# EAGLE design lvds-omnetics_BOB (EAGLE 6.4)
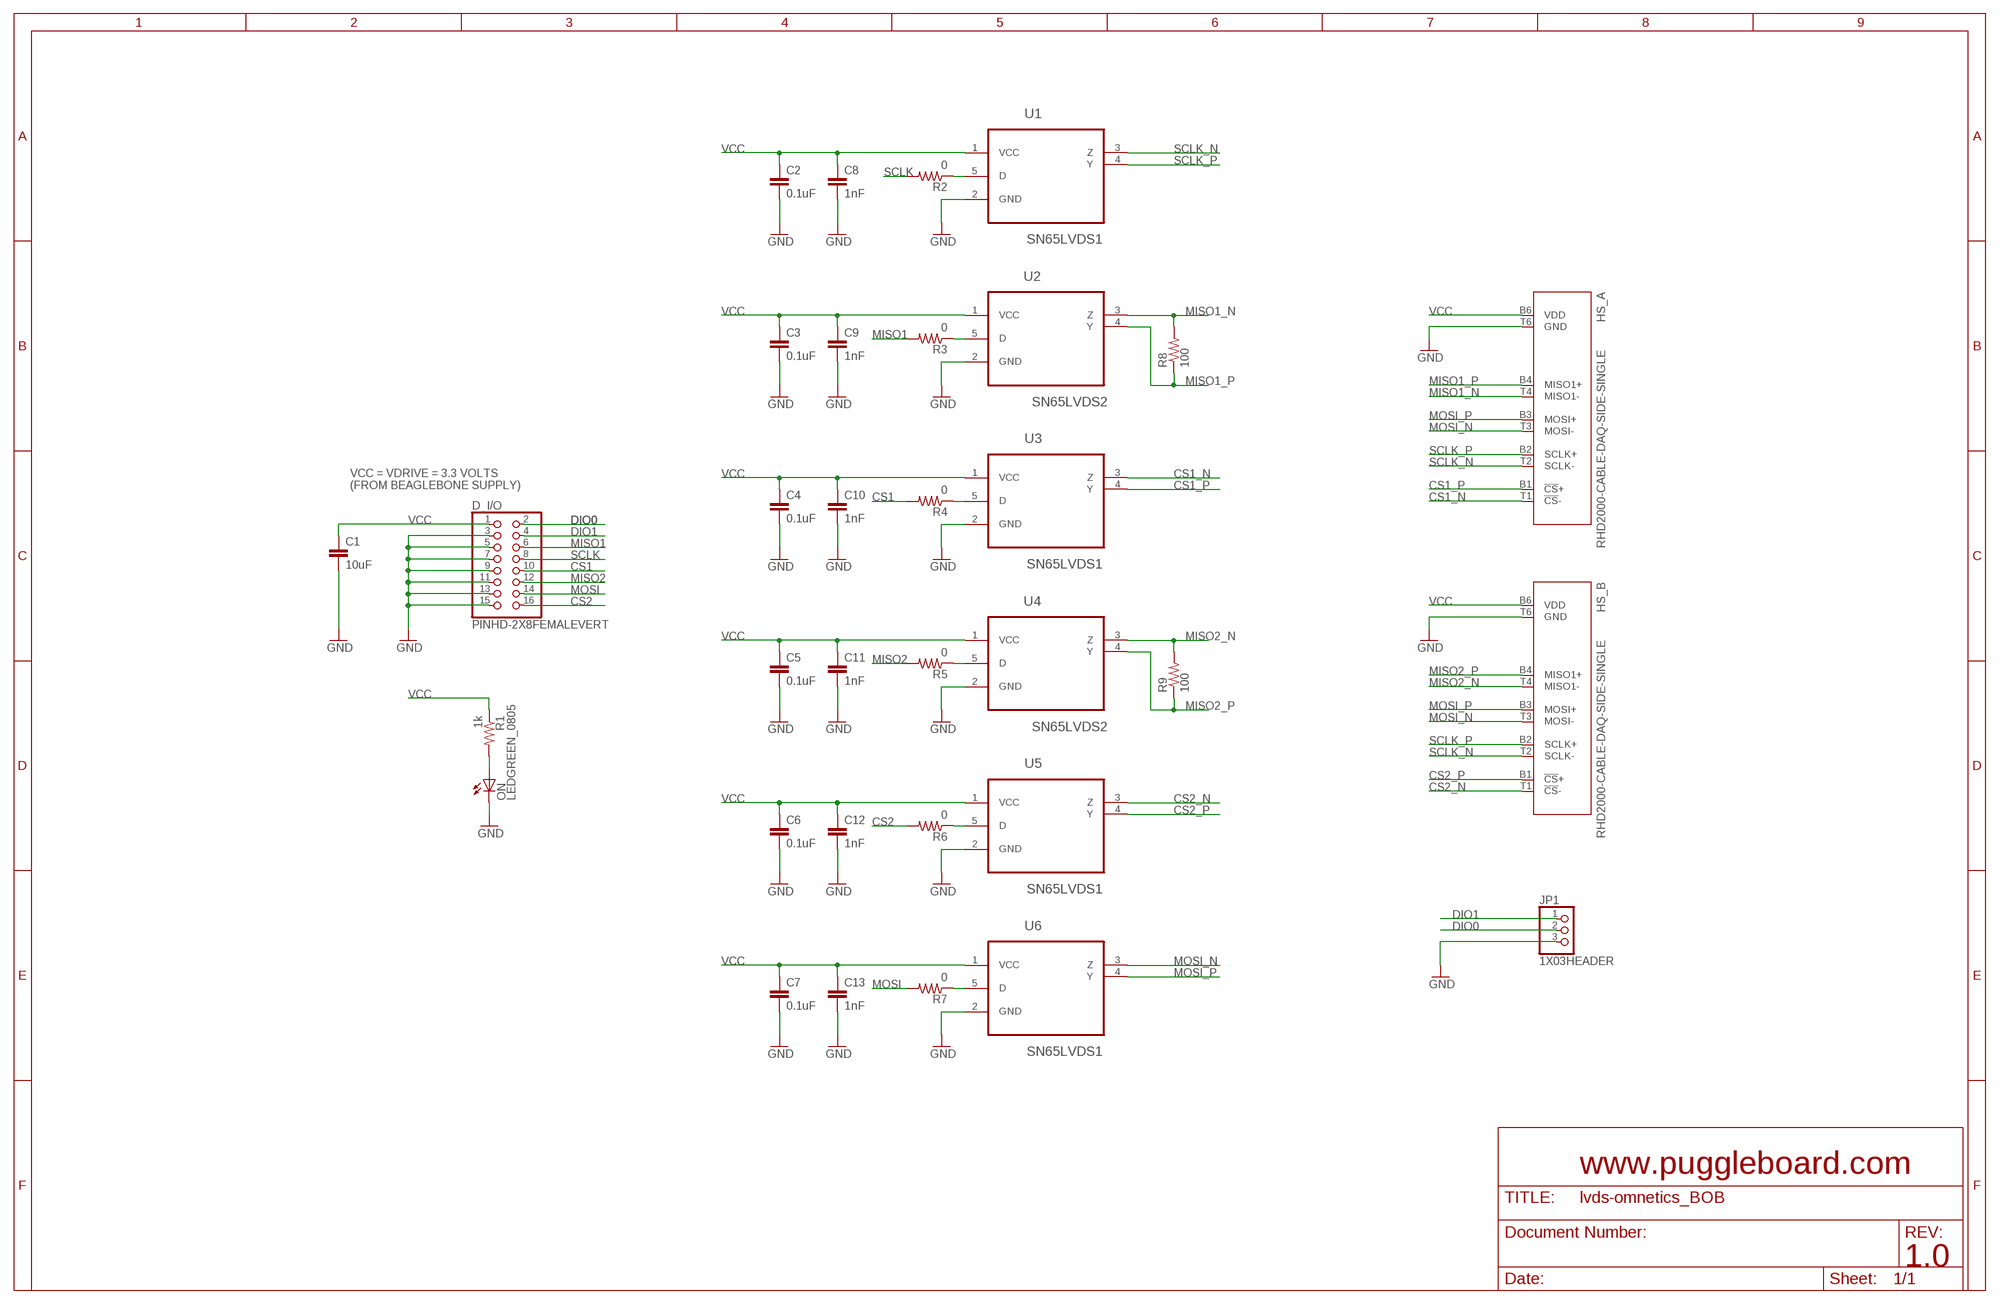
[diagram p0: schematic, sheet 1]

## Parts
C1  10uF  C_0805  [0805]
C2  0.1uF  C_0603  [0603]
C3  0.1uF  C_0603  [0603]
C4  0.1uF  C_0603  [0603]
C5  0.1uF  C_0603  [0603]
C6  0.1uF  C_0603  [0603]
C7  0.1uF  C_0603  [0603]
C8  1nF  C_0603  [0603]
C9  1nF  C_0603  [0603]
C10  1nF  C_0603  [0603]
C11  1nF  C_0603  [0603]
C12  1nF  C_0603  [0603]
C13  1nF  C_0603  [0603]
D_I/O  PINHD-2X8FEMALEVERT  [2X08]
HS_A  RHD2000-CABLE-DAQ-SIDE-SINGLE  [OMNETICS_PZN_12_AA-SINGLEBUS]
HS_B  RHD2000-CABLE-DAQ-SIDE-SINGLE  [OMNETICS_PZN_12_AA-SINGLEBUS]
JP1  1X03HEADER  PINHD-1X3/90  [1X03]
ON  LEDGREEN_0805  [CHIP-LED0805]
R1  1k  R_0603  [0603]
R2  0  R_0603  [0603]
R3  0  R_0603  [0603]
R4  0  R_0603  [0603]
R5  0  R_0603  [0603]
R6  0  R_0603  [0603]
R7  0  R_0603  [0603]
R8  100  R_0603  [0603]
R9  100  R_0603  [0603]
U1  SN65LVDS1  SN65LVDS1DBVR  [SOT95P280X145-5N]
U2  SN65LVDS2  SN65LVDS2DBVR  [SOT95P280X145-5N]
U3  SN65LVDS1  SN65LVDS1DBVR  [SOT95P280X145-5N]
U4  SN65LVDS2  SN65LVDS2DBVR  [SOT95P280X145-5N]
U5  SN65LVDS1  SN65LVDS1DBVR  [SOT95P280X145-5N]
U6  SN65LVDS1  SN65LVDS1DBVR  [SOT95P280X145-5N]

## Nets
CS1: D_I/O.10 R4.2
CS1_N [diffpair]: HS_A.T1(!CS!-) U3.3(Z)
CS1_P [diffpair]: HS_A.B1(!CS!+) U3.4(Y)
CS2: D_I/O.16 R6.2
CS2_N [diffpair]: HS_B.T1(!CS!-) U5.3(Z)
CS2_P [diffpair]: HS_B.B1(!CS!+) U5.4(Y)
DIO0: D_I/O.2 JP1.2
DIO1: D_I/O.4 JP1.1
GND [gnd]: C1.2 C2.2 C3.2 C4.2 C5.2 C6.2 C7.2 C8.2 C9.2 C10.2 C11.2 C12.2 C13.2 D_I/O.3 D_I/O.5 D_I/O.7 D_I/O.9 D_I/O.11 D_I/O.13 D_I/O.15 HS_A.T6(GND) HS_B.T6(GND) JP1.3 ON.C U1.2(GND) U2.2(GND) U3.2(GND) U4.2(GND) U5.2(GND) U6.2(GND)
MISO1: D_I/O.6 R3.2
MISO1_N [diffpair]: HS_A.T4(MISO1-) R8.2 U2.3(Z)
MISO1_P [diffpair]: HS_A.B4(MISO1+) R8.1 U2.4(Y)
MISO2: D_I/O.12 R5.2
MISO2_N [diffpair]: HS_B.T4(MISO1-) R9.2 U4.3(Z)
MISO2_P [diffpair]: HS_B.B4(MISO1+) R9.1 U4.4(Y)
MOSI: D_I/O.14 R7.2
MOSI_N [diffpair]: HS_A.T3(MOSI-) HS_B.T3(MOSI-) U6.3(Z)
MOSI_P [diffpair]: HS_A.B3(MOSI+) HS_B.B3(MOSI+) U6.4(Y)
N$2: R3.1 U2.5(D)
N$3: R4.1 U3.5(D)
N$4: R5.1 U4.5(D)
N$5: R6.1 U5.5(D)
N$6: R7.1 U6.5(D)
N$7: R2.1 U1.5(D)
N$9: ON.A R1.2
SCLK: D_I/O.8 R2.2
SCLK_N [diffpair]: HS_A.T2(SCLK-) HS_B.T2(SCLK-) U1.3(Z)
SCLK_P [diffpair]: HS_A.B2(SCLK+) HS_B.B2(SCLK+) U1.4(Y)
VCC [supply]: C1.1 C2.1 C3.1 C4.1 C5.1 C6.1 C7.1 C8.1 C9.1 C10.1 C11.1 C12.1 C13.1 D_I/O.1 HS_A.B6(VDD) HS_B.B6(VDD) R1.1 U1.1(VCC) U2.1(VCC) U3.1(VCC) U4.1(VCC) U5.1(VCC) U6.1(VCC)

## Notes on the sheet
- VCC = VDRIVE = 3.3 VOLTS 
  (FROM BEAGLEBONE SUPPLY)
- www.puggleboard.com
- 1.0

## Library data of the parts
C1 = puggleboard:C: Capacitor; MN: TDK Corp.; PARTNO: C2012X5R1Cxxxxxxx; VID: DK
C2-C13 = puggleboard:C: Capacitor
D_I/O = puggleboard:PINHD-2X8; DK: S7111-ND; MN: Sullins; MPN: PPPC082LFBN-RC
HS_A HS_B = puggleboard:RHD2000-CABLE-DAQ-SIDE-SINGLE
JP1 = puggleboard:PINHD-1X3: PIN HEADER; DK: 3M9468-ND; MN: 3M; MPN: 961103-5604-AR
ON = puggleboard:LED; DK: 350-2044-1-ND; MN: 598-8170-107F; MPN: Dialight
R1-R9 = puggleboard:R: Resistor; DK: PxxxxHTR-ND; MN: Panasonic; MPN: ERJ-3EKFxxxxV
U1 U3 U5 U6 = ti-extended:SN65LVDS1DBVR: HIGH-SPEED DIFFERENTIAL LINE DRIVER/RECEIVERS; DIGIKEY: 296-6919-1-ND; MPN: SN65LVDS1DBVR; OC_FARNELL: -; OC_NEWARK: 76C0715; PACKAGE: SOT-23-5; SUPPLIER: Texas Instruments
U2 U4 = ti-extended:SN65LVDS2DBVR: HIGH-SPEED DIFFERENTIAL LINE DRIVER/RECEIVERS; DIGIKEY: 296-6920-1-ND; MPN: SN65LVDS2DBVR; OC_FARNELL: 1652269; OC_NEWARK: 76C0744; PACKAGE: SOT-23-5; SUPPLIER: Texas Instruments

## Net classes
1 supply: width 0.254 mm
2 diffpair: width 0.178 mm
3 gnd: width 0.254 mm

## Board
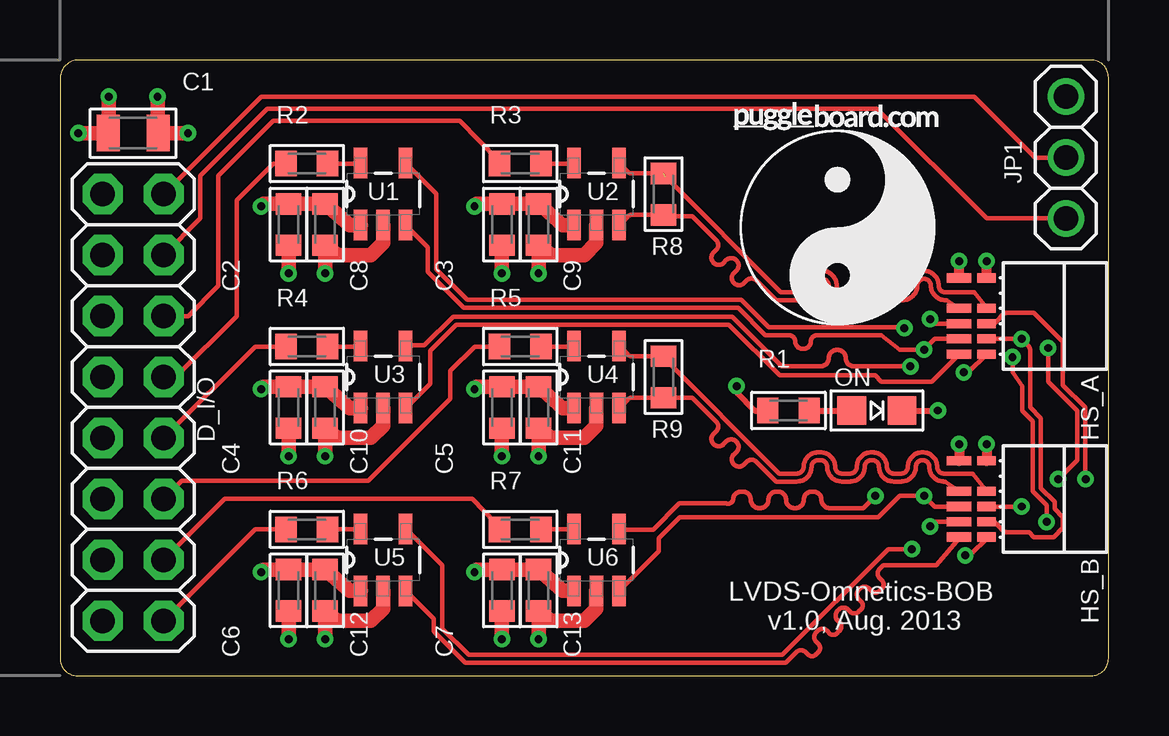
[diagram p1: board, top side]
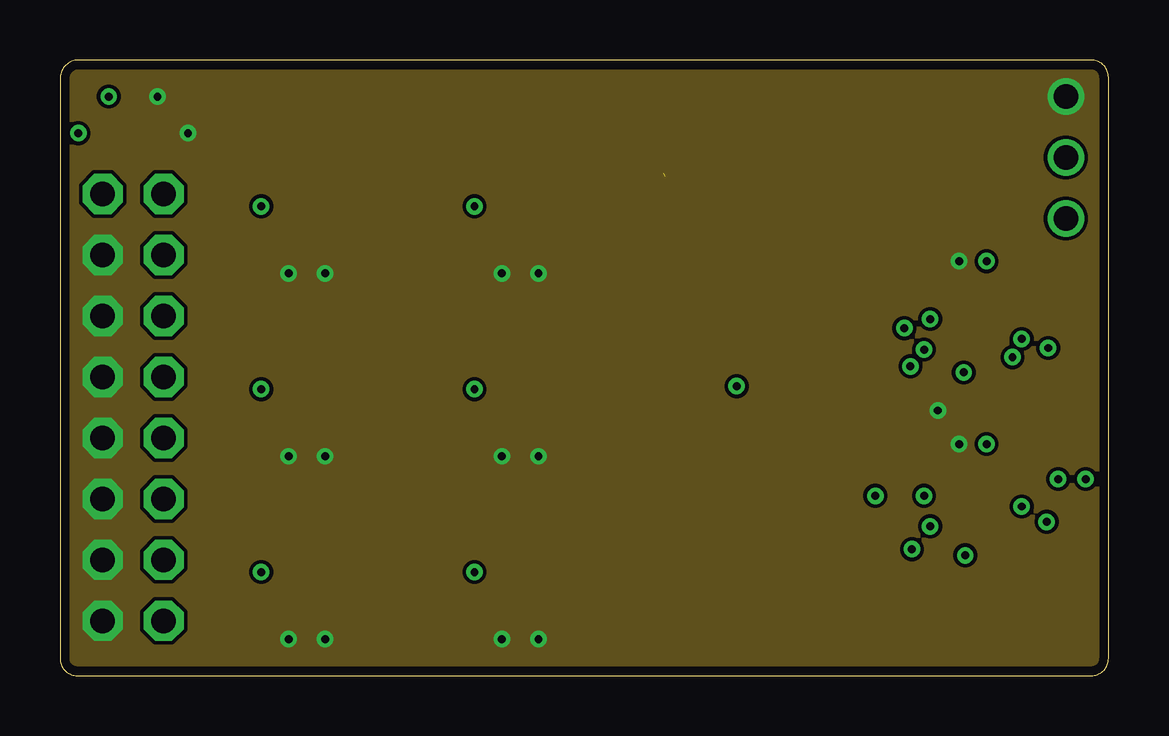
[diagram p2: board, inner layer Ground]
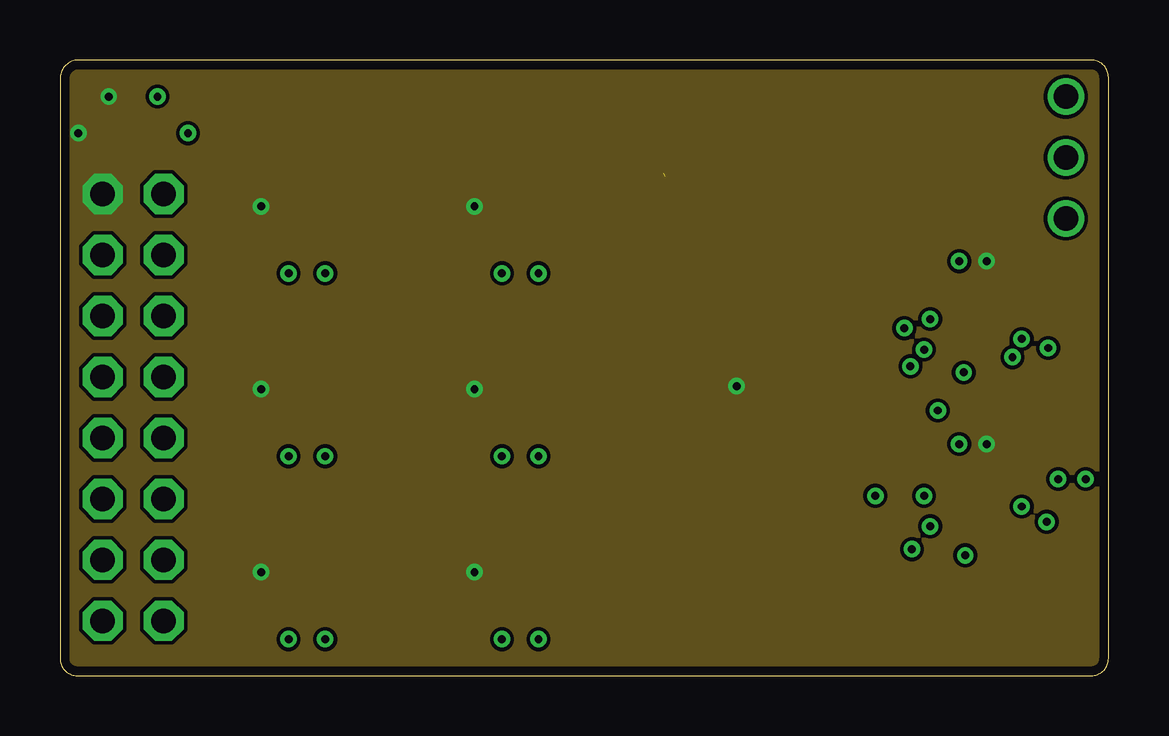
[diagram p3: board, inner layer Supply]
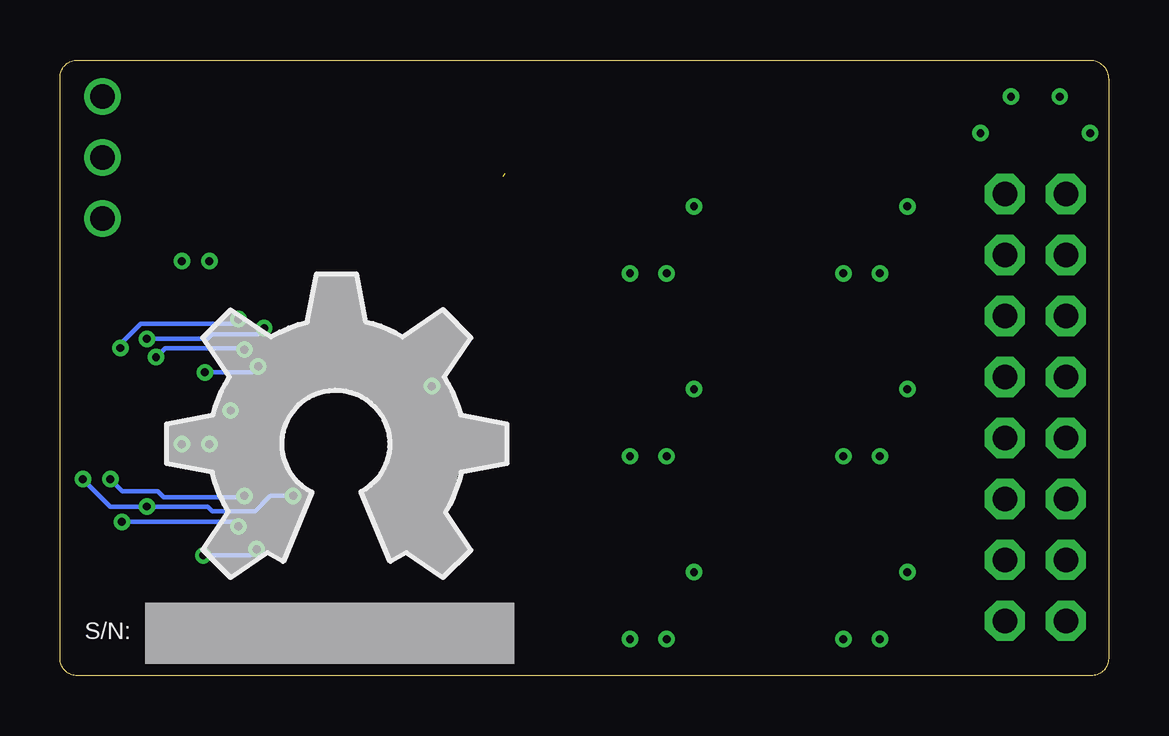
[diagram p4: board, bottom side, seen from below]

Size 43.69 x 25.65 mm. Coordinates in mm from the lower left corner, seen from the top.
Outline: 0,24.85 0,0.72 arc90 0.72,0 42.97,0 arc90 43.69,0.72 43.69,24.94 arc90 42.97,25.65 0.76,25.65 arc90 0,24.85
Copper layers (1+2*15+16): Top 0.0356mm / dielectric 1.5011mm / Ground 0.0356mm / dielectric 0.1499mm / Supply 0.0356mm / dielectric 0.2007mm / Bottom 0.0356mm
Design rules "ohs-park-mod": minimum track width 6mil, minimum drill 13mil, track to track 6mil, track to pad 6mil, pad to pad 6mil, via to via 6mil, smd to smd 6mil, copper to edge 15mil, drill to drill 6mil, minimum pad ring 7mil, minimum via ring 7mil, stop-mask expansion 4mil, vias tented up to drill 15mil, thermal gap 10mil

### Footprints (pad centres in the part's own frame; a part is rotated, then mirrored left to right if it is on the bottom)
0805 = smd 0.965 x 1.524: 1 -1.041,0; 2 1.041,0
0603 = smd 0.889 x 1.067: 1 -0.864,0; 2 0.864,0
2X08 = drill 1.016 pad 1.676 octagon: 1 -8.89,-1.27; 2 -8.89,1.27; 3 -6.35,-1.27; 4 -6.35,1.27; 5 -3.81,-1.27; 6 -3.81,1.27; 7 -1.27,-1.27; 8 -1.27,1.27; 9 1.27,-1.27; 10 1.27,1.27; 11 3.81,-1.27; 12 3.81,1.27; 13 6.35,-1.27; 14 6.35,1.27; 15 8.89,-1.27; 16 8.89,1.27
OMNETICS_PZN_12_AA-SINGLEBUS = smd 0.381 x 0.762: B1 1.587,-2.286; B2 0.953,-2.286; B3 0.318,-2.286; B4 -0.318,-2.286; B6 -1.587,-2.286 | smd 0.381 x 1.016: T1 1.587,-3.429; T2 0.953,-3.429; T3 0.318,-3.429; T4 -0.318,-3.429; T6 -1.587,-3.429
1X03 = drill 1.016: 1 -2.54,0; 2 0,0; 3 2.54,0
CHIP-LED0805 = smd 1.2 x 1.2: A 0,-1.05; C 0,1.05
SOT95P280X145-5N = smd 1.27 x 0.559: 1 -1.295,0.94; 2 -1.295,0; 3 -1.295,-0.94; 4 1.295,-0.94; 5 1.295,0.94

### Placement (x,y rotation side)
C1  3.05,22.61 0 top
C2  9.53,18.8 270 top
C3  18.41,18.8 270 top
C4  9.53,11.18 270 top
C5  18.41,11.18 270 top
C6  9.53,3.56 270 top
C7  18.41,3.56 270 top
C8  11.05,18.8 270 top
C9  19.94,18.8 270 top
C10  11.05,11.18 270 top
C11  19.94,11.18 270 top
C12  11.05,3.56 270 top
C13  19.94,3.56 270 top
D_I/O  3.05,11.18 270 top
HS_A  40.89,14.99 270 top
HS_B  40.89,7.37 270 top
JP1  41.91,21.59 90 top
ON  34.04,11.05 270 top
R1  30.35,11.05 0 top
R2  10.29,21.34 180 top
R3  19.18,21.34 180 top
R4  10.29,13.72 180 top
R5  19.18,13.72 180 top
R6  10.29,6.1 180 top
R7  19.18,6.1 180 top
R8  25.15,20.07 270 top
R9  25.15,12.45 270 top
U1  13.46,20.07 90 top
U2  22.35,20.07 90 top
U3  13.46,12.45 90 top
U4  22.35,12.45 90 top
U5  13.46,4.83 90 top
U6  22.35,4.83 90 top
U$1  [PB-LOGO]  28.07,14.61 0 top
U$2  [OSHW_FILLX500_NOTEXT]  39.24,4.06 0 bottom

### Tracks (layer width: path | path; a pad name or v marks a point on that pad's centre or on a via)
CS1
  Top 0.178: D_I/O.10 8.13,13.72 R4.2
CS1_N
  Top 0.178: HS_A.T1 36.32,12.26 34.23,12.26 33.97,12.51 29.99,12.51 27.87,14.63 16.52,14.63 15.42,13.54 15.42,12.17 U3.3
CS1_P  (via drill 0.33)
  Top 0.178: HS_A.B1 37.85,12.64 v37.66,12.64 | v35.43,12.89 33.08,12.89 arc-90 32.74,13.23 arc90 32.4,13.58 32.37,13.58 arc90 32.03,13.23 arc-90 31.69,12.89 30.08,12.89 28.01,14.96 16.38,14.96 15.19,13.77 14.43,13.77 U3.4
  Bottom 0.178: v37.66,12.64 35.69,12.64 v35.43,12.89
CS2
  Top 0.178: D_I/O.16 8.13,6.1 R6.2
CS2_N
  Top 0.178: 37.53,5.78 37.5,5.75 | 37.5,5.75 36.51,4.6 34.3,4.6 34.15,4.46 arc90 34.15,4.06 34.28,3.94 arc-90 34.21,3.6 34.17,3.57 arc-90 33.84,3.5 33.72,3.62 arc90 33.32,3.62 33.28,3.59 arc90 33.28,3.19 33.41,3.07 arc-90 33.34,2.74 33.3,2.7 arc-90 32.97,2.63 32.85,2.76 arc90 32.45,2.76 32.39,2.7 arc90 32.39,2.3 32.52,2.18 arc-90 32.45,1.85 32.41,1.81 arc-90 32.08,1.74 31.96,1.87 arc90 31.56,1.87 31.5,1.81 arc90 31.5,1.41 31.63,1.29 arc-90 31.57,0.96 31.52,0.92 arc-90 31.19,0.85 31.07,0.98 arc90 30.68,0.98 30.23,0.53 16.89,0.53 15.57,1.85 15.57,2.37 U5.3 | HS_B.T1 37.5,5.75
CS2_P  (via drill 0.33)
  Top 0.178: v37.72,5.02 37.91,5.02 38.67,5.78 HS_B.B1 | v35.5,5.27 34.5,5.27 30.09,0.86 17.02,0.86 15.93,1.96 15.93,4.59 U5.4
  Bottom 0.178: v37.72,5.02 35.75,5.02 v35.5,5.27
DIO0
  Top 0.178: D_I/O.2 8.38,24.13 38.1,24.13 40.64,21.59 JP1.2
DIO1
  Top 0.178: D_I/O.4 5.84,19.05 5.84,20.83 8.64,23.62 34.04,23.62 38.61,19.05 JP1.1
GND  (via drill 0.33)
  Top 0.254: ON.C v36.58,11.05
  Top 0.406: v37.47,9.65 HS_B.T6 | HS_A.T6 v37.47,17.27
  Top 0.61: C1.2 v5.33,22.61 | v4.06,24.13 4.06,22.61 | U1.2 13.46,18.03 12.95,17.53 11.58,17.53 C8.2 v11.05,16.76 | v9.53,16.76 C2.2 | U3.2 13.46,10.41 12.95,9.91 11.58,9.91 C10.2 v11.05,9.14 | U5.2 13.46,2.79 12.95,2.29 11.58,2.29 C12.2 v11.05,1.52 | U4.2 22.35,10.41 21.84,9.91 20.47,9.91 C11.2 v19.94,9.14 | U2.2 22.35,18.03 21.84,17.53 20.47,17.53 C9.2 v19.94,16.76 | U6.2 22.35,2.79 21.84,2.29 20.47,2.29 C13.2 v19.94,1.52 | v18.41,16.76 C3.2 | v9.53,9.14 C4.2 | v18.41,9.14 C5.2 | v18.41,1.52 C7.2 | v9.53,1.52 C6.2
  pour Ground (no thermals): 0,25.65 0,0 43.69,0 43.69,25.65
MISO1
  Top 0.178: R3.2 18.31,21.44 18.29,21.46 16.66,23.11 8.89,23.11 6.6,20.83 6.6,16.26 5.33,14.99 D_I/O.6
MISO1_N
  Top 0.178: U2.3 23.65,19.13 arc-45 23.83,19.2 R8.2 25.15,19.14 26.35,19.14 27.35,18.14 arc-90 27.35,17.74 27.22,17.62 arc90 27.22,17.22 27.25,17.2 arc90 27.64,17.2 27.77,17.32 arc-90 28.17,17.32 28.19,17.29 arc-90 28.19,16.9 28.07,16.77 arc90 28.07,16.38 28.1,16.35 arc90 28.49,16.35 28.62,16.47 arc-90 29.01,16.47 29.84,15.65 30.77,15.65 arc90 31.38,16.26 arc-90 31.66,16.54 31.75,16.54 arc-90 32.03,16.26 arc90 32.64,15.65 32.98,15.65 arc90 33.59,16.26 arc-90 33.87,16.54 33.91,16.54 arc-90 34.19,16.26 arc90 34.8,15.65 35.11,15.65 arc90 35.72,16.26 arc-90 36,16.54 36.01,16.54 arc-90 36.28,16.26 arc90 36.89,15.65 36.96,15.65 37.53,15.24 HS_A.T4
MISO1_P  (1 unrouted)
  Top 0.178: U2.4 23.65,21 arc45 23.83,20.93 R8.1 | 25.21,20.81 30.04,15.98 30.77,15.98 arc90 31.05,16.26 arc-90 31.66,16.87 31.75,16.87 arc-90 32.36,16.26 arc90 32.64,15.98 32.98,15.98 arc90 33.26,16.26 arc-90 33.87,16.87 33.91,16.87 arc-90 34.52,16.26 arc90 34.8,15.98 35.11,15.98 arc90 35.39,16.26 arc-90 36,16.87 36.01,16.87 arc-90 36.61,16.26 arc90 36.89,15.98 38.1,15.98 38.67,15.24 HS_A.B4
MISO2
  Top 0.178: R5.2 17.27,13.72 16.26,12.7 16.26,11.53 12.85,8.13 5.08,8.13 D_I/O.12
MISO2_N
  Top 0.178: U4.3 23.65,11.51 arc-45 23.83,11.58 R9.2 26.35,11.58 27.35,10.58 arc-90 27.35,10.19 27.22,10.06 arc90 27.22,9.67 27.25,9.64 arc90 27.64,9.64 27.77,9.76 arc-90 28.17,9.76 28.19,9.74 arc-90 28.19,9.34 28.07,9.21 arc90 28.07,8.82 28.1,8.79 arc90 28.49,8.79 28.62,8.92 arc-90 29.01,8.92 29.84,8.09 30.7,8.09 arc90 31.31,8.7 arc-90 31.59,8.98 31.69,8.98 arc-90 31.97,8.7 arc90 32.58,8.09 32.92,8.09 arc90 33.53,8.7 arc-90 33.81,8.98 33.85,8.98 arc-90 34.12,8.7 arc90 34.73,8.09 35.05,8.09 arc90 35.66,8.7 arc-90 35.94,8.98 35.94,8.98 arc-90 36.22,8.7 arc90 36.83,8.09 36.89,8.09 HS_B.T4
MISO2_P
  Top 0.178: U4.4 23.65,13.38 arc45 23.83,13.31 R9.1 25.15,13.25 29.98,8.42 30.7,8.42 arc90 30.98,8.7 arc-90 31.59,9.31 31.69,9.31 arc-90 32.3,8.7 arc90 32.58,8.42 32.92,8.42 arc90 33.2,8.7 arc-90 33.81,9.31 33.85,9.31 arc-90 34.45,8.7 arc90 34.73,8.42 35.05,8.42 arc90 35.33,8.7 arc-90 35.94,9.31 35.94,9.31 arc-90 36.55,8.7 arc90 36.83,8.42 38.04,8.42 HS_B.B4
MOSI
  Top 0.178: R7.2 18.31,6.2 18.16,6.35 17.17,7.37 6.86,7.37 D_I/O.14
MOSI_N  (via drill 0.33)
  Top 0.178: HS_A.T3 36.45,14.67 v36.26,14.86 | HS_B.T3 36.45,7.05 v36.01,7.49 | v36.01,7.49 34.99,7.49 34.1,6.6 25.82,6.6 24.95,5.72 24.95,5.18 U6.3 | v36.01,7.49 36.07,7.43 | v41.59,8.19 42.38,8.98 42.38,11.04 41.17,12.25 v41.17,13.65
  Bottom 0.178: v36.26,14.86 36.45,14.67 40.32,14.67 41.17,13.82 v41.17,13.65 | v36.01,7.49 36.07,7.43 39.37,7.43 39.62,7.68 41.08,7.68 v41.59,8.19
MOSI_P  (via drill 0.33)
  Top 0.178: HS_A.B3 38.92,14.67 39.37,15.11 40.58,15.11 41.78,13.91 41.78,12.11 42.71,11.18 42.71,8.22 v42.74,8.19 | v40.07,7.05 HS_B.B3 38.54,7.05 | v33.97,7.49 33.47,6.99 32.07,6.99 arc-90 31.73,7.33 arc90 31.38,7.67 31.33,7.67 arc90 30.99,7.33 arc-90 30.65,6.99 30.6,6.99 arc-90 30.25,7.33 arc90 29.91,7.67 29.86,7.67 arc90 29.52,7.33 arc-90 29.18,6.99 29.12,6.99 arc-90 28.78,7.33 arc90 28.44,7.67 28.39,7.67 arc90 28.05,7.33 arc-90 27.77,7.18 25.8,7.18 24.71,6.09 23.33,6.09 U6.4
  Bottom 0.178: v42.74,8.19 41.59,7.05 v40.07,7.05 37.53,7.05 37.34,6.86 35.56,6.86 34.92,7.49 v33.97,7.49
N$2
  Top 0.178: R3.1 21.39,21.34 U2.5
N$3
  Top 0.178: R4.1 12.5,13.72 U3.5
N$4
  Top 0.178: R5.1 21.39,13.72 U4.5
N$5
  Top 0.178: R6.1 12.5,6.1 U5.5
N$6
  Top 0.178: R7.1 21.39,6.1 U6.5
N$7
  Top 0.178: R2.1 12.5,21.34 U1.5
N$9
  Top 0.254: R1.2 ON.A
SCLK
  Top 0.178: R2.2 8.89,21.34 7.37,19.81 7.37,14.99 4.83,12.45 D_I/O.8
SCLK_N  (via drill 0.33)
  Top 0.178: HS_A.T2 36.45,14.03 v36.01,13.59 34.99,13.59 34.23,14.19 31.56,14.19 arc90 31.28,13.91 arc-90 31,13.63 30.92,13.63 arc-90 30.64,13.91 arc90 30.36,14.19 29.4,14.19 28.25,15.33 16.82,15.33 15.31,16.84 15.31,17.86 U1.3 | v39.69,13.27 39.69,12.64 40.09,12.06 40.09,11.04 40.54,10.6 40.54,7.68 41.11,7.11 v41.11,6.41 | HS_B.T2 36.45,6.41 v36.26,6.22
  Bottom 0.178: v39.69,13.27 39.31,13.65 36.07,13.65 v36.01,13.59 | v36.26,6.22 36.45,6.41 v41.11,6.41
SCLK_P  (via drill 0.33)
  Top 0.178: HS_A.B2 v40.07,14.03 40.39,13.72 40.42,13.59 40.42,11.18 40.87,10.74 40.87,7.82 41.44,7.24 41.44,6.95 41.78,6.6 41.78,6.16 41.4,5.78 40.58,5.78 40.39,5.97 39.37,5.97 38.92,6.41 HS_B.B2 | U1.4 15.67,20.09 15.67,16.94 16.96,15.66 28.39,15.66 29.53,14.52 35.14,14.52 v35.18,14.48
  Bottom 0.178: v40.07,14.03 37.53,14.03 37.34,14.22 35.43,14.22 v35.18,14.48
VCC  (via drill 0.33)
  Top 0.254: v28.19,12.06 28.19,11.81 28.96,11.05 R1.1
  Top 0.406: v38.61,9.65 HS_B.B6 | HS_A.B6 v38.61,17.27
  Top 0.61: v0.76,22.61 C1.1 2.03,22.63 v2.03,24.13 | v17.27,11.94 17.37,12.04 C5.1 C11.1 20.95,11.15 U4.1 | v17.27,19.56 17.37,19.66 C3.1 C9.1 20.95,18.77 U2.1 | v8.38,19.56 8.48,19.66 C2.1 C8.1 12.06,18.77 U1.1 | v8.38,4.32 8.48,4.42 C6.1 C12.1 12.06,3.53 U5.1 | v17.27,4.32 17.37,4.42 C7.1 C13.1 20.95,3.53 U6.1 | 9.55,11.94 C4.1 | C4.1 C10.1 12.06,11.15 U3.1 | v8.38,11.94 8.48,12.04 C4.1
  pour Supply (no thermals): 0,25.65 0,0 43.69,0 43.69,25.65

### Text on the board
tPlace: LVDS-Omnetics-BOB / v1.0, Aug. 2013
bPlace: S/N: